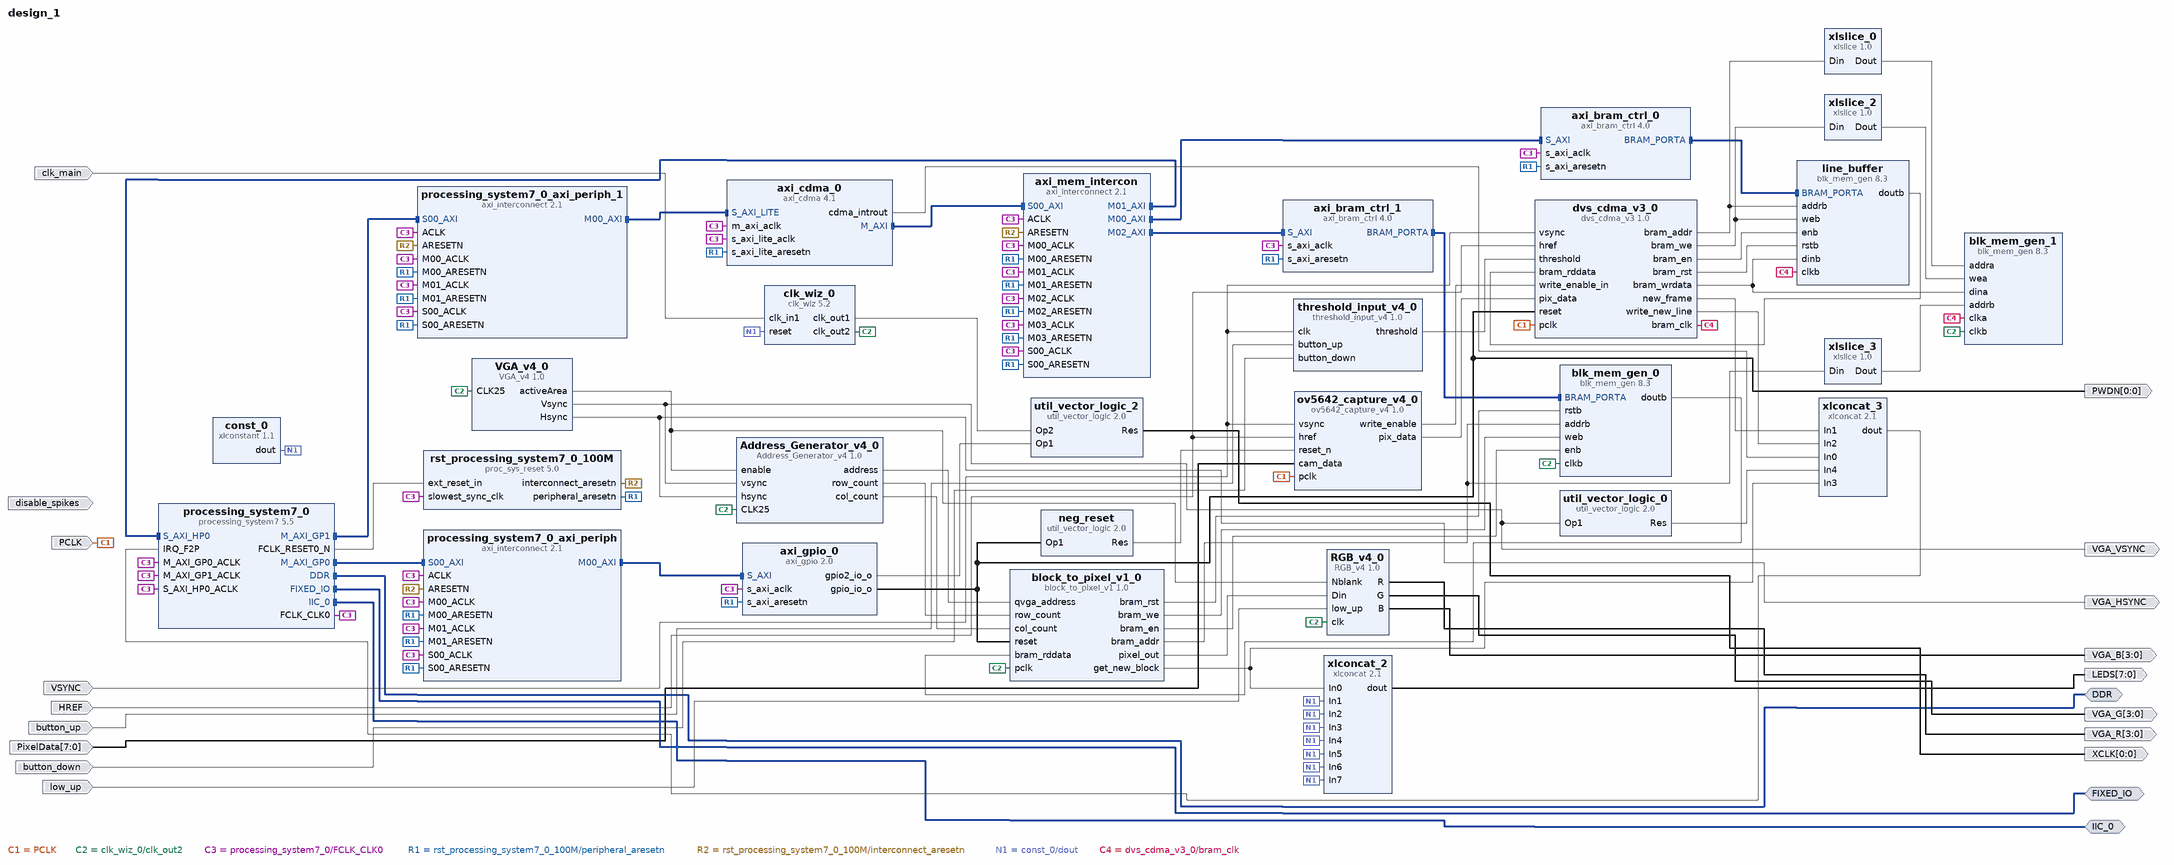
[diagram p0: block diagram of the top level]
# Vivado block design design_1, Vivado 2015.3
create_bd_design design_1

create_bd_intf_port -mode Master -vlnv xilinx.com:interface:ddrx_rtl:1.0 DDR
create_bd_intf_port -mode Master -vlnv xilinx.com:display_processing_system7:fixedio_rtl:1.0 FIXED_IO
create_bd_intf_port -mode Master -vlnv xilinx.com:interface:iic_rtl:1.0 IIC_0
create_bd_port -dir I disable_spikes
create_bd_port -dir I PCLK
create_bd_port -dir O VGA_VSYNC
create_bd_port -dir O VGA_HSYNC
create_bd_port -dir I VSYNC
create_bd_port -dir O -from 0 -to 0 PWDN
create_bd_port -dir O -from 0 -to 0 XCLK
create_bd_port -dir I -type clk clk_main
set_property -dict {CONFIG.FREQ_HZ 100000000} [get_bd_ports clk_main]
create_bd_port -dir I -from 7 -to 0 PixelData
create_bd_port -dir I HREF
create_bd_port -dir I button_up
create_bd_port -dir I button_down
create_bd_port -dir O -from 3 -to 0 VGA_R
create_bd_port -dir O -from 3 -to 0 VGA_G
create_bd_port -dir O -from 3 -to 0 VGA_B
create_bd_port -dir I low_up
create_bd_port -dir O -from 7 -to 0 LEDS

create_bd_cell -type ip -vlnv xilinx.com:ip:processing_system7:5.5 processing_system7_0
set_property -dict [list \
  CONFIG.PCW_FPGA0_PERIPHERAL_FREQMHZ 250 \
  CONFIG.PCW_USE_M_AXI_GP1 1 \
  CONFIG.PCW_USE_S_AXI_HP0 1 \
  CONFIG.PCW_USE_FABRIC_INTERRUPT 1 \
  CONFIG.PCW_IRQ_F2P_INTR 1 \
  CONFIG.PCW_QSPI_GRP_SINGLE_SS_ENABLE 1 \
  CONFIG.PCW_I2C0_PERIPHERAL_ENABLE 1 \
  CONFIG.preset ZedBoard \
] [get_bd_cells processing_system7_0]
# 14 more settings of processing_system7_0 are not shown: defaults, MIO pin electricals, DDR timing, and values the tool derives
create_bd_cell -type ip -vlnv xilinx.com:ip:clk_wiz:5.2 clk_wiz_0
set_property -dict [list \
  CONFIG.CLKOUT2_USED true \
  CONFIG.CLKOUT3_USED true \
  CONFIG.NUM_OUT_CLKS 3 \
  CONFIG.CLKOUT1_REQUESTED_OUT_FREQ 24 \
  CONFIG.CLKOUT2_REQUESTED_OUT_FREQ 25 \
  CONFIG.CLKOUT3_REQUESTED_OUT_FREQ 50 \
  CONFIG.MMCM_DIVCLK_DIVIDE 1 \
  CONFIG.MMCM_CLKFBOUT_MULT_F 10.500 \
  CONFIG.MMCM_CLKOUT0_DIVIDE_F 43.750 \
  CONFIG.MMCM_CLKOUT1_DIVIDE 42 \
  CONFIG.MMCM_CLKOUT2_DIVIDE 21 \
  CONFIG.CLKOUT1_JITTER 170.969 \
  CONFIG.CLKOUT1_PHASE_ERROR 94.994 \
  CONFIG.CLKOUT2_JITTER 169.602 \
  CONFIG.CLKOUT2_PHASE_ERROR 94.994 \
  CONFIG.CLKOUT3_JITTER 145.943 \
  CONFIG.CLKOUT3_PHASE_ERROR 94.994 \
] [get_bd_cells clk_wiz_0]
create_bd_cell -type ip -vlnv xilinx.com:ip:axi_gpio:2.0 axi_gpio_0
set_property -dict [list \
  CONFIG.C_GPIO_WIDTH 1 \
  CONFIG.C_GPIO2_WIDTH 1 \
  CONFIG.C_IS_DUAL 1 \
  CONFIG.C_ALL_INPUTS 0 \
  CONFIG.USE_BOARD_FLOW true \
  CONFIG.GPIO_BOARD_INTERFACE Custom \
  CONFIG.C_ALL_OUTPUTS 1 \
  CONFIG.C_ALL_OUTPUTS_2 1 \
] [get_bd_cells axi_gpio_0]
create_bd_cell -type ip -vlnv xilinx.com:ip:axi_interconnect:2.1 processing_system7_0_axi_periph
set_property -dict [list \
  CONFIG.NUM_MI 2 \
  CONFIG.STRATEGY 2 \
  CONFIG.ENABLE_ADVANCED_OPTIONS 0 \
  CONFIG.S00_HAS_DATA_FIFO 2 \
] [get_bd_cells processing_system7_0_axi_periph]
create_bd_cell -type ip -vlnv xilinx.com:ip:proc_sys_reset:5.0 rst_processing_system7_0_100M
create_bd_cell -type ip -vlnv xilinx.com:ip:xlconstant:1.1 const_0
set_property -dict {CONFIG.CONST_VAL 0} [get_bd_cells const_0]
create_bd_cell -type ip -vlnv xilinx.com:ip:util_vector_logic:2.0 util_vector_logic_2
set_property -dict {CONFIG.C_SIZE 1} [get_bd_cells util_vector_logic_2]
create_bd_cell -type ip -vlnv xilinx.com:ip:util_vector_logic:2.0 neg_reset
set_property -dict {CONFIG.C_SIZE 1 CONFIG.C_OPERATION not} [get_bd_cells neg_reset]
create_bd_cell -type ip -vlnv user.org:user:threshold_input_v4:1.0 threshold_input_v4_0
create_bd_cell -type ip -vlnv user.org:user:VGA_v4:1.0 VGA_v4_0
create_bd_cell -type ip -vlnv user.org:user:RGB_v4:1.0 RGB_v4_0
create_bd_cell -type ip -vlnv xilinx.com:ip:blk_mem_gen:8.3 line_buffer
set_property -dict [list \
  CONFIG.Memory_Type True_Dual_Port_RAM \
  CONFIG.Enable_B Use_ENB_Pin \
  CONFIG.Use_RSTB_Pin true \
  CONFIG.Port_B_Clock 100 \
  CONFIG.Port_B_Write_Rate 50 \
  CONFIG.Port_B_Enable_Rate 100 \
] [get_bd_cells line_buffer]
create_bd_cell -type ip -vlnv xilinx.com:ip:axi_cdma:4.1 axi_cdma_0
set_property -dict [list \
  CONFIG.C_M_AXI_MAX_BURST_LEN 256 \
  CONFIG.C_USE_DATAMOVER_LITE 0 \
  CONFIG.C_INCLUDE_DRE 0 \
  CONFIG.C_INCLUDE_SG 0 \
] [get_bd_cells axi_cdma_0]
create_bd_cell -type ip -vlnv xilinx.com:ip:axi_bram_ctrl:4.0 axi_bram_ctrl_0
set_property -dict {CONFIG.SINGLE_PORT_BRAM 1} [get_bd_cells axi_bram_ctrl_0]
create_bd_cell -type ip -vlnv xilinx.com:ip:axi_interconnect:2.1 axi_mem_intercon
set_property -dict {CONFIG.NUM_MI 4} [get_bd_cells axi_mem_intercon]
create_bd_cell -type ip -vlnv xilinx.com:ip:axi_interconnect:2.1 processing_system7_0_axi_periph_1
set_property -dict {CONFIG.NUM_MI 2} [get_bd_cells processing_system7_0_axi_periph_1]
create_bd_cell -type ip -vlnv user.org:user:ov5642_capture_v4:1.0 ov5642_capture_v4_0
create_bd_cell -type ip -vlnv xilinx.com:ip:xlconcat:2.1 xlconcat_2
set_property -dict {CONFIG.NUM_PORTS 8} [get_bd_cells xlconcat_2]
create_bd_cell -type ip -vlnv xilinx.com:ip:xlconcat:2.1 xlconcat_3
set_property -dict {CONFIG.NUM_PORTS 5} [get_bd_cells xlconcat_3]
create_bd_cell -type ip -vlnv xilinx.com:ip:blk_mem_gen:8.3 blk_mem_gen_0
set_property -dict [list \
  CONFIG.Memory_Type True_Dual_Port_RAM \
  CONFIG.Enable_B Use_ENB_Pin \
  CONFIG.Use_RSTB_Pin true \
  CONFIG.Port_B_Clock 100 \
  CONFIG.Port_B_Write_Rate 50 \
  CONFIG.Port_B_Enable_Rate 100 \
] [get_bd_cells blk_mem_gen_0]
create_bd_cell -type ip -vlnv xilinx.com:ip:axi_bram_ctrl:4.0 axi_bram_ctrl_1
set_property -dict {CONFIG.SINGLE_PORT_BRAM 1} [get_bd_cells axi_bram_ctrl_1]
create_bd_cell -type ip -vlnv user.org:user:Address_Generator_v4:1.0 Address_Generator_v4_0
create_bd_cell -type ip -vlnv xilinx.com:ip:blk_mem_gen:8.3 blk_mem_gen_1
set_property -dict [list \
  CONFIG.Memory_Type Simple_Dual_Port_RAM \
  CONFIG.Enable_32bit_Address false \
  CONFIG.Use_Byte_Write_Enable false \
  CONFIG.Write_Depth_A 2048 \
  CONFIG.Operating_Mode_A NO_CHANGE \
  CONFIG.Enable_A Always_Enabled \
  CONFIG.Enable_B Always_Enabled \
  CONFIG.Register_PortB_Output_of_Memory_Primitives true \
  CONFIG.Port_B_Clock 100 \
  CONFIG.Port_B_Enable_Rate 100 \
  CONFIG.use_bram_block Stand_Alone \
] [get_bd_cells blk_mem_gen_1]
create_bd_cell -type ip -vlnv xilinx.com:ip:xlslice:1.0 xlslice_0
set_property -dict {CONFIG.DOUT_WIDTH 11 CONFIG.DIN_FROM 10} [get_bd_cells xlslice_0]
create_bd_cell -type ip -vlnv xilinx.com:ip:xlslice:1.0 xlslice_2
set_property -dict {CONFIG.DIN_TO 0 CONFIG.DIN_FROM 0 CONFIG.DIN_WIDTH 4} [get_bd_cells xlslice_2]
create_bd_cell -type ip -vlnv xilinx.com:ip:xlslice:1.0 xlslice_3
set_property -dict {CONFIG.DOUT_WIDTH 11 CONFIG.DIN_FROM 10} [get_bd_cells xlslice_3]
create_bd_cell -type ip -vlnv xilinx.com:ip:util_vector_logic:2.0 util_vector_logic_0
set_property -dict {CONFIG.C_SIZE 1 CONFIG.C_OPERATION not} [get_bd_cells util_vector_logic_0]
create_bd_cell -type ip -vlnv user.org:user:dvs_cdma_v3:1.0 dvs_cdma_v3_0
set_property -dict {CONFIG.MAX_LIFE_COUNT 2} [get_bd_cells dvs_cdma_v3_0]
create_bd_cell -type ip -vlnv user.org:user:block_to_pixel_v1:1.0 block_to_pixel_v1_0
set_property -dict {CONFIG.MAX_LIFE_COUNT 2 CONFIG.DEFAULT_GRAY_LEVEL 7} [get_bd_cells block_to_pixel_v1_0]

# ---- connections ----

connect_bd_intf_net [get_bd_intf_pins processing_system7_0/M_AXI_GP0] [get_bd_intf_pins processing_system7_0_axi_periph/S00_AXI]
connect_bd_intf_net [get_bd_intf_pins processing_system7_0_axi_periph/M00_AXI] [get_bd_intf_pins axi_gpio_0/S_AXI]
connect_bd_intf_net [get_bd_intf_pins line_buffer/BRAM_PORTA] [get_bd_intf_pins axi_bram_ctrl_0/BRAM_PORTA]
connect_bd_intf_net [get_bd_intf_pins axi_cdma_0/M_AXI] [get_bd_intf_pins axi_mem_intercon/S00_AXI]
connect_bd_intf_net [get_bd_intf_pins axi_mem_intercon/M00_AXI] [get_bd_intf_pins axi_bram_ctrl_0/S_AXI]
connect_bd_intf_net [get_bd_intf_pins axi_mem_intercon/M01_AXI] [get_bd_intf_pins processing_system7_0/S_AXI_HP0]
connect_bd_intf_net [get_bd_intf_pins processing_system7_0/M_AXI_GP1] [get_bd_intf_pins processing_system7_0_axi_periph_1/S00_AXI]
connect_bd_intf_net [get_bd_intf_pins processing_system7_0_axi_periph_1/M00_AXI] [get_bd_intf_pins axi_cdma_0/S_AXI_LITE]
connect_bd_intf_net [get_bd_intf_pins axi_bram_ctrl_1/BRAM_PORTA] [get_bd_intf_pins blk_mem_gen_0/BRAM_PORTA]
connect_bd_intf_net [get_bd_intf_pins axi_mem_intercon/M02_AXI] [get_bd_intf_pins axi_bram_ctrl_1/S_AXI]
connect_bd_intf_net [get_bd_intf_ports DDR] [get_bd_intf_pins processing_system7_0/DDR]
connect_bd_intf_net [get_bd_intf_ports FIXED_IO] [get_bd_intf_pins processing_system7_0/FIXED_IO]
connect_bd_intf_net [get_bd_intf_ports IIC_0] [get_bd_intf_pins processing_system7_0/IIC_0]
connect_bd_net -net ov5642_capture_v3_0_write_enable [get_bd_pins ov5642_capture_v4_0/write_enable] [get_bd_pins dvs_cdma_v3_0/write_enable_in]
connect_bd_net [get_bd_ports PCLK] [get_bd_pins ov5642_capture_v4_0/pclk] [get_bd_pins dvs_cdma_v3_0/pclk]
connect_bd_net [get_bd_pins clk_wiz_0/clk_out2] \
  [get_bd_pins VGA_v4_0/CLK25] [get_bd_pins RGB_v4_0/clk] [get_bd_pins blk_mem_gen_0/clkb] \
  [get_bd_pins Address_Generator_v4_0/CLK25] [get_bd_pins blk_mem_gen_1/clkb] [get_bd_pins block_to_pixel_v1_0/pclk]
connect_bd_net -net VGA_v3_0_activeArea [get_bd_pins VGA_v4_0/activeArea] [get_bd_pins RGB_v4_0/Nblank] [get_bd_pins Address_Generator_v4_0/enable]
connect_bd_net -net VGA_v3_0_Vsync [get_bd_pins VGA_v4_0/Vsync] \
  [get_bd_ports VGA_VSYNC] [get_bd_pins Address_Generator_v4_0/vsync] [get_bd_pins util_vector_logic_0/Op1]
connect_bd_net -net VGA_v3_0_Hsync [get_bd_pins VGA_v4_0/Hsync] [get_bd_ports VGA_HSYNC] [get_bd_pins Address_Generator_v4_0/hsync]
connect_bd_net [get_bd_ports VSYNC] [get_bd_pins threshold_input_v4_0/clk] [get_bd_pins ov5642_capture_v4_0/vsync] [get_bd_pins dvs_cdma_v3_0/vsync]
connect_bd_net [get_bd_pins processing_system7_0/FCLK_CLK0] \
  [get_bd_pins processing_system7_0/M_AXI_GP0_ACLK] [get_bd_pins axi_gpio_0/s_axi_aclk] \
  [get_bd_pins rst_processing_system7_0_100M/slowest_sync_clk] [get_bd_pins axi_cdma_0/m_axi_aclk] \
  [get_bd_pins axi_bram_ctrl_0/s_axi_aclk] [get_bd_pins processing_system7_0/M_AXI_GP1_ACLK] \
  [get_bd_pins axi_cdma_0/s_axi_lite_aclk] [get_bd_pins processing_system7_0/S_AXI_HP0_ACLK] \
  [get_bd_pins axi_bram_ctrl_1/s_axi_aclk] [get_bd_pins processing_system7_0_axi_periph/S00_ACLK] \
  [get_bd_pins processing_system7_0_axi_periph/ACLK] [get_bd_pins processing_system7_0_axi_periph/M00_ACLK] \
  [get_bd_pins processing_system7_0_axi_periph/M01_ACLK] [get_bd_pins axi_mem_intercon/S00_ACLK] \
  [get_bd_pins axi_mem_intercon/ACLK] [get_bd_pins axi_mem_intercon/M00_ACLK] \
  [get_bd_pins processing_system7_0_axi_periph_1/S00_ACLK] [get_bd_pins processing_system7_0_axi_periph_1/ACLK] \
  [get_bd_pins processing_system7_0_axi_periph_1/M00_ACLK] [get_bd_pins axi_mem_intercon/M01_ACLK] \
  [get_bd_pins processing_system7_0_axi_periph_1/M01_ACLK] [get_bd_pins axi_mem_intercon/M02_ACLK] \
  [get_bd_pins axi_mem_intercon/M03_ACLK]
connect_bd_net [get_bd_pins processing_system7_0/FCLK_RESET0_N] [get_bd_pins rst_processing_system7_0_100M/ext_reset_in]
connect_bd_net [get_bd_pins rst_processing_system7_0_100M/peripheral_aresetn] \
  [get_bd_pins axi_gpio_0/s_axi_aresetn] [get_bd_pins axi_bram_ctrl_0/s_axi_aresetn] \
  [get_bd_pins axi_cdma_0/s_axi_lite_aresetn] [get_bd_pins axi_bram_ctrl_1/s_axi_aresetn] \
  [get_bd_pins processing_system7_0_axi_periph/S00_ARESETN] [get_bd_pins processing_system7_0_axi_periph/M00_ARESETN] \
  [get_bd_pins processing_system7_0_axi_periph/M01_ARESETN] [get_bd_pins axi_mem_intercon/S00_ARESETN] \
  [get_bd_pins axi_mem_intercon/M00_ARESETN] [get_bd_pins processing_system7_0_axi_periph_1/S00_ARESETN] \
  [get_bd_pins processing_system7_0_axi_periph_1/M00_ARESETN] [get_bd_pins axi_mem_intercon/M01_ARESETN] \
  [get_bd_pins processing_system7_0_axi_periph_1/M01_ARESETN] [get_bd_pins axi_mem_intercon/M02_ARESETN] \
  [get_bd_pins axi_mem_intercon/M03_ARESETN]
connect_bd_net [get_bd_pins rst_processing_system7_0_100M/interconnect_aresetn] \
  [get_bd_pins processing_system7_0_axi_periph/ARESETN] [get_bd_pins axi_mem_intercon/ARESETN] \
  [get_bd_pins processing_system7_0_axi_periph_1/ARESETN]
connect_bd_net -net xlconstant_0_dout [get_bd_pins const_0/dout] \
  [get_bd_pins clk_wiz_0/reset] [get_bd_pins xlconcat_2/In5] [get_bd_pins xlconcat_2/In6] [get_bd_pins xlconcat_2/In7] \
  [get_bd_pins xlconcat_2/In1] [get_bd_pins xlconcat_2/In4] [get_bd_pins xlconcat_2/In3] [get_bd_pins xlconcat_2/In2]
connect_bd_net [get_bd_pins axi_gpio_0/gpio_io_o] \
  [get_bd_ports PWDN] [get_bd_pins neg_reset/Op1] [get_bd_pins dvs_cdma_v3_0/reset] [get_bd_pins block_to_pixel_v1_0/reset]
connect_bd_net [get_bd_pins util_vector_logic_2/Res] [get_bd_ports XCLK]
connect_bd_net [get_bd_pins clk_wiz_0/clk_out1] [get_bd_pins util_vector_logic_2/Op2]
connect_bd_net [get_bd_pins axi_gpio_0/gpio2_io_o] [get_bd_pins util_vector_logic_2/Op1]
connect_bd_net [get_bd_ports clk_main] [get_bd_pins clk_wiz_0/clk_in1]
connect_bd_net [get_bd_ports PixelData] [get_bd_pins ov5642_capture_v4_0/cam_data]
connect_bd_net [get_bd_ports HREF] [get_bd_pins ov5642_capture_v4_0/href] [get_bd_pins dvs_cdma_v3_0/href]
connect_bd_net -net util_vector_logic_3_Res [get_bd_pins neg_reset/Res] [get_bd_pins ov5642_capture_v4_0/reset_n]
connect_bd_net [get_bd_ports button_up] [get_bd_pins threshold_input_v4_0/button_up]
connect_bd_net [get_bd_ports button_down] [get_bd_pins threshold_input_v4_0/button_down]
connect_bd_net [get_bd_pins RGB_v4_0/R] [get_bd_ports VGA_R]
connect_bd_net [get_bd_pins RGB_v4_0/G] [get_bd_ports VGA_G]
connect_bd_net [get_bd_pins RGB_v4_0/B] [get_bd_ports VGA_B]
connect_bd_net [get_bd_ports low_up] [get_bd_pins RGB_v4_0/low_up]
connect_bd_net [get_bd_pins axi_cdma_0/cdma_introut] [get_bd_pins xlconcat_3/In0]
connect_bd_net [get_bd_pins xlconcat_2/dout] [get_bd_ports LEDS]
connect_bd_net [get_bd_pins xlconcat_3/dout] [get_bd_pins processing_system7_0/IRQ_F2P]
connect_bd_net -net dvs_cdma_v2_0_new_frame [get_bd_pins dvs_cdma_v3_0/new_frame] [get_bd_pins xlconcat_3/In1]
connect_bd_net -net dvs_cdma_v2_0_write_new_line [get_bd_pins dvs_cdma_v3_0/write_new_line] [get_bd_pins xlconcat_3/In2]
connect_bd_net [get_bd_pins ov5642_capture_v4_0/pix_data] [get_bd_pins dvs_cdma_v3_0/pix_data]
connect_bd_net [get_bd_pins threshold_input_v4_0/threshold] [get_bd_pins dvs_cdma_v3_0/threshold]
connect_bd_net [get_bd_pins line_buffer/doutb] [get_bd_pins dvs_cdma_v3_0/bram_rddata]
connect_bd_net [get_bd_pins dvs_cdma_v3_0/bram_addr] [get_bd_pins line_buffer/addrb] [get_bd_pins xlslice_0/Din]
connect_bd_net [get_bd_pins dvs_cdma_v3_0/bram_clk] [get_bd_pins line_buffer/clkb] [get_bd_pins blk_mem_gen_1/clka]
connect_bd_net [get_bd_pins dvs_cdma_v3_0/bram_wrdata] [get_bd_pins line_buffer/dinb] [get_bd_pins blk_mem_gen_1/dina]
connect_bd_net [get_bd_pins dvs_cdma_v3_0/bram_en] [get_bd_pins line_buffer/enb]
connect_bd_net [get_bd_pins dvs_cdma_v3_0/bram_rst] [get_bd_pins line_buffer/rstb]
connect_bd_net [get_bd_pins dvs_cdma_v3_0/bram_we] [get_bd_pins line_buffer/web] [get_bd_pins xlslice_2/Din]
connect_bd_net [get_bd_pins block_to_pixel_v1_0/pixel_out] [get_bd_pins RGB_v4_0/Din]
connect_bd_net [get_bd_pins Address_Generator_v4_0/address] [get_bd_pins block_to_pixel_v1_0/qvga_address]
connect_bd_net [get_bd_pins Address_Generator_v4_0/row_count] [get_bd_pins block_to_pixel_v1_0/row_count]
connect_bd_net [get_bd_pins Address_Generator_v4_0/col_count] [get_bd_pins block_to_pixel_v1_0/col_count]
connect_bd_net [get_bd_pins block_to_pixel_v1_0/bram_rst] [get_bd_pins blk_mem_gen_0/rstb]
connect_bd_net [get_bd_pins block_to_pixel_v1_0/bram_we] [get_bd_pins blk_mem_gen_0/web]
connect_bd_net [get_bd_pins block_to_pixel_v1_0/bram_en] [get_bd_pins blk_mem_gen_0/enb]
connect_bd_net [get_bd_pins block_to_pixel_v1_0/get_new_block] [get_bd_pins xlconcat_3/In3] [get_bd_pins xlconcat_2/In0]
connect_bd_net [get_bd_pins xlslice_0/Dout] [get_bd_pins blk_mem_gen_1/addra]
connect_bd_net [get_bd_pins xlslice_2/Dout] [get_bd_pins blk_mem_gen_1/wea]
connect_bd_net [get_bd_pins block_to_pixel_v1_0/bram_addr] [get_bd_pins xlslice_3/Din] [get_bd_pins blk_mem_gen_0/addrb]
connect_bd_net [get_bd_pins xlslice_3/Dout] [get_bd_pins blk_mem_gen_1/addrb]
connect_bd_net [get_bd_pins blk_mem_gen_0/doutb] [get_bd_pins block_to_pixel_v1_0/bram_rddata]
connect_bd_net [get_bd_pins util_vector_logic_0/Res] [get_bd_pins xlconcat_3/In4]

# ---- address map ----
assign_bd_address -offset 0x00000000 -range 512M -target_address_space [get_bd_addr_spaces axi_cdma_0/Data] [get_bd_addr_segs processing_system7_0/S_AXI_HP0/HP0_DDR_LOWOCM]
assign_bd_address -offset 0x00000000 -range 512M -target_address_space [get_bd_addr_spaces axi_cdma_0/Data] [get_bd_addr_segs processing_system7_0/S_AXI_HP1/HP1_DDR_LOWOCM]
assign_bd_address -offset 0xC0000000 -range 16K -target_address_space [get_bd_addr_spaces axi_cdma_0/Data] [get_bd_addr_segs axi_bram_ctrl_0/S_AXI/Mem0]
assign_bd_address -offset 0xC2000000 -range 16K -target_address_space [get_bd_addr_spaces axi_cdma_0/Data] [get_bd_addr_segs axi_bram_ctrl_1/S_AXI/Mem0]
assign_bd_address -offset 0x41200000 -range 4K -target_address_space [get_bd_addr_spaces processing_system7_0/Data] [get_bd_addr_segs axi_gpio_0/S_AXI/Reg]
assign_bd_address -offset 0x8E200000 -range 16K -target_address_space [get_bd_addr_spaces processing_system7_0/Data] [get_bd_addr_segs axi_cdma_0/S_AXI_LITE/Reg]

validate_bd_design
save_bd_design
